# Altium schematic sheet Buffer_EXC.SchDoc
size A4; CompanyName: Technische Hochschule Nürnberg Georg Simon Ohm; DrawnBy: Bauer Martin; Engineer: Bauer Martin; Organization: UltraZohm; Address1: Kesslerplatz 12; Address2: 90489 Nürnberg; Address3: GERMANY; DocumentNumber: 4; SheetNumber: 4; SheetTotal: 6; Website: www.ultrazohm.com
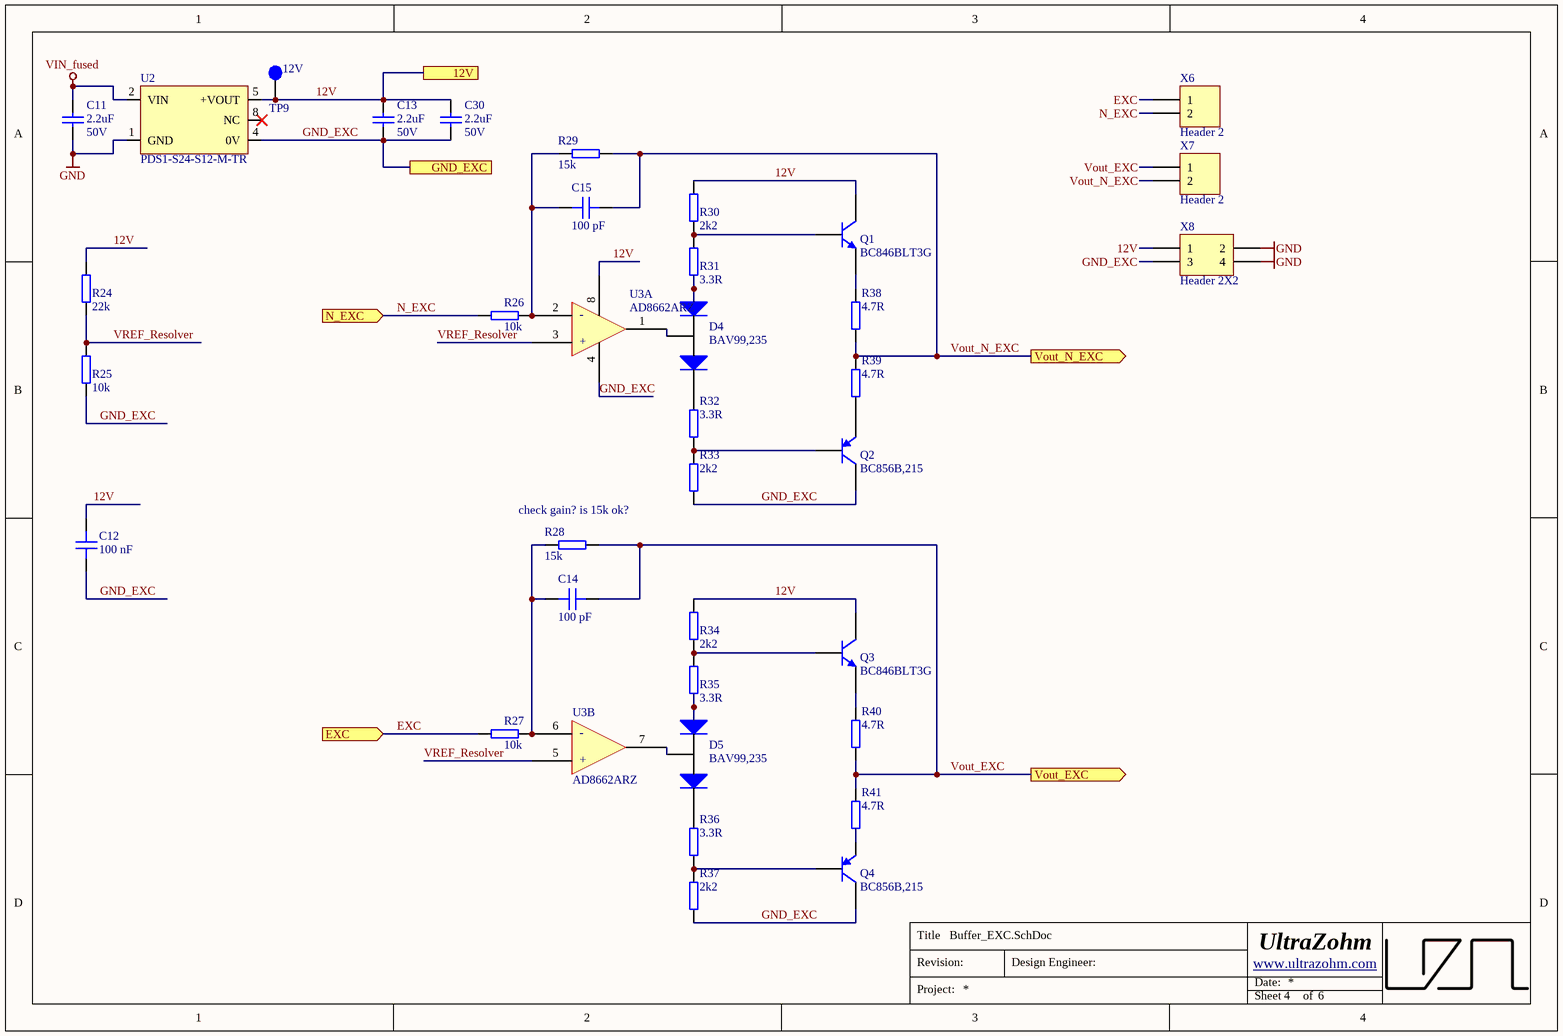
[diagram p0: Buffer_EXC.SchDoc]

## Parts
C11  2.2uF  Voltage: 50V  [RES_1206]
C12  100 nF  [C_0603]
C13  2.2uF  Voltage: 50V  [RES_1206]
C14  100 pF  [C_0603]
C15  100 pF  [C_0603]
C30  2.2uF  Voltage: 50V  [RES_1206]
D4  BAV99,235  [SOT-23]
D5  BAV99,235  [SOT-23]
Q1  BC846BLT3G  [SOT-23]
Q2  BC856B,215  [SOT-23]
Q3  BC846BLT3G  [SOT-23]
Q4  BC856B,215  [SOT-23]
R24  22k  [RES 0603_1608]
R25  10k  [RES 0603_1608]
R26  10k  [RES 0603_1608]
R27  10k  [RES 0603_1608]
R28  15k  [RES 0603_1608]
R29  15k  [RES 0603_1608]
R30  2k2  [RES 0603_1608]
R31  3.3R  [RES 0603_1608]
R32  3.3R  [RES 0603_1608]
R33  2k2  [RES 0603_1608]
R34  2k2  [RES 0603_1608]
R35  3.3R  [RES 0603_1608]
R36  3.3R  [RES 0603_1608]
R37  2k2  [RES 0603_1608]
R38  4.7R  [RES 0603_1608]
R39  4.7R  [RES 0603_1608]
R40  4.7R  [RES 0603_1608]
R41  4.7R  [RES 0603_1608]
TP9  12V  [TP_1mm]  (no BOM)
U2  PDS1-S24-S12-M-TR  [DC/DC 24V-->12V 1W Aislado]
U3  AD8662ARZ  [SOIC8_N]  (parts A,B of 2)
X6  Header 2  [HDR1X2]
X7  Header 2  [HDR1X2]
X8  Header 2X2  [HDR2X2]

## Ports
12V, EXC (in), GND_EXC, N_EXC (in), Vout_EXC (out), Vout_N_EXC (out)

## Nets
GND: C11.2 U2.1(GND) X8.2 X8.4
VIN_fused: C11.1 U2.2(VIN)
12V: C12.1 C13.1 C30.1 Q1.3(C) Q3.3(C) R24.2 R30.2 R34.2 TP9.1 U2.5(+VOUT) U3.8(v-) X8.1 ; port 12V
EXC: R27.2 X6.1 ; port EXC
GND_EXC: C12.2 C13.2 C30.2 Q2.3(C) Q4.3(C) R25.1 R33.2 R37.2 U2.4(0V) U3.4(v+) X8.3 ; port GND_EXC
N_EXC: R26.2 X6.2 ; port N_EXC
Vout_EXC: C14.2 R28.2 R40.2 R41.1 X7.1 ; port Vout_EXC
Vout_N_EXC: C15.2 R29.2 R38.2 R39.1 X7.2 ; port Vout_N_EXC
VREF_Resolver: R24.1 R25.2 U3.3(+in_a) U3.5(+in_b)
NetC14_1: C14.1 R27.1 R28.1 U3.6(-in_b)
NetC15_1: C15.1 R26.1 R29.1 U3.2(-in_a)
NetD4_1: D4.1 R31.1
NetD4_2: D4.2 R32.1
NetD4_3: D4.3 U3.1(out_a)
NetD5_1: D5.1 R35.1
NetD5_2: D5.2 R36.1
NetD5_3: D5.3 U3.7(out_b)
NetQ1_1: Q1.1(B) R30.1 R31.2
NetQ1_2: Q1.2(E) R38.1
NetQ2_1: Q2.1(B) R32.2 R33.1
NetQ2_2: Q2.2(E) R39.2
NetQ3_1: Q3.1(B) R34.1 R35.2
NetQ3_2: Q3.2(E) R40.1
NetQ4_1: Q4.1(B) R36.2 R37.1
NetQ4_2: Q4.2(E) R41.2

Not connected (* = marked no-connect by the designer): U2 8(NC)* 15(NC) 16(NC) 17(NC) 26(NC) 27(NC)

## Notes on the sheet
- check gain? is 15k ok?
- Title
- Revision:
- Design Engineer:
- Date:
- Project:
- Sheet
- of
- (in symbol AD8662, part A) -; +
- (in symbol AD8662, part B) -; +

## Library data of the parts
C11 C13 C30 = Cap_1206: Capacitor; Digikey Part-Number: *; Value: 2.2uF; Manufacturer Part-Number: *; LCSC Part Number: C50254
C12 = CC0603KRX7R9BB104: Capacitor 0603, 50 VDC, 100 nF, X7R; Manufacturer: YAGEO; Tolerance: 10 %; Voltage Rating: 50 VDC; Created from: AGeiger; Value: 100 nF; Supplier 1: LCSC; Supplier 2: Mouser; Supplier Part Number 1: C14663; Supplier Part Number 2: 603-CC603KRX7R9BB104; Manufacturer Part Number: CC0603KRX7R9BB104; PartID: 102; Created On: 22.08.2022 14:35:53; ComponentLink1Description: Datasheet; ComponentLink1URL: https://datasheet.lcsc.com/lcsc/1809301912_YAGEO-CC0603KRX7R9BB104_C14663.pdf; Component Type: Capacitor 0603; Device Package: 0603; Last Updated: 22.08.2022 14:35:53; Mounting Type: SMD; Operating Temperature: -55 - 125°C; Series: X7R; Type: Capacitor; Live Cycle Status: 1; LCSC Part Number: C14663
C14 C15 = CL10C101JB8NNNC: 50V 100pF C0G ±5% 0603 Multilayer Ceramic Capacitors MLCC - SMD/SMT ROHS; Manufacturer: Samsung Electro-Mechanics; Voltage Rating: 50 VDC; Created from: AGeiger; Value: 100 pF; Supplier 1: LCSC; Supplier Part Number 1: C14858; Manufacturer Part Number: CL10C101JB8NNNC; PartID: 106; Created On: 03.09.2022 10:55:28; ComponentLink1Description: Datasheet; ComponentLink1URL: https://datasheet.lcsc.com/lcsc/1811151136_Samsung-Electro-Mechanics-CL10C101JB8NNNC_C14858.pdf; Component Type: Capacitor 0603; Device Package: 0603; Last Updated: 03.09.2022 10:55:28; Mounting Type: SMD; Operating Temperature: -55 - 125°C; Series: C0G; Type: Capacitor; Tolerance: 5 %; Live Cycle Status: 1; LCSC Part Number: C14858
D4 D5 = Diode Array: DIODE ARRAY GP 100V 215MA SOT23; MF: Nexperia; Supplier Part Number 2: 1727-4311-1-ND; MPN: BAV99,235; Supplier 1: Mouser; Supplier 2: Digi-Key; Package: SOT-23-3; Supplier Part Number 1: 771-BAV99235; LCSC Part Number: C2500
Q1 Q3 = NPN Transistor BC846: NPN Bipolar Transistor; MF: ON Semiconductor; Supplier Part Number 2: BC846BLT3GOSCT-ND; MPN: BC846BLT3G; Supplier 1: Mouser; Supplier 2: Digi-Key; Supplier Part Number 1: 863-BC846BLT3G; Package: SOT-23-3; LCSC Part Number: C513271
Q2 Q4 = PNP Transistor BC846: PNP Bipolar Transistor; MF: Nexperia; Supplier Part Number 2: 1727-2925-1-ND; MPN: BC856B,215; Supplier Part Number 1: 771-BC856B-T/R; Supplier 1: Mouser; Supplier 2: Digi-Key; Package: SOT-23-3; LCSC Part Number: C109310
R24 = RK73B1JTTD223J: SMD resistor E24 series; Manufacturer: KOA Speer; Tolerance: 5%; Created from: MGremer; Value: 22k; Supplier 1: Mouser; Supplier Part Number 1: 660-RK73B1JTTD223J; Manufacturer Part Number: RK73B1JTTD223J; PartID: 106; Created On: 14.12.2020 16:17:14; ComponentLink1Description: Datasheet; ComponentLink1URL: https://www.mouser.de/datasheet/2/219/RK73B-1825463.pdf; Component Type: SMD resistor; Device Package: 0603; Last Updated: 01.02.2023 09:52:31; Mounting Type: SMD; Type: Resistor; Live Cycle Status: 1; Stock number: Labor SMD Container; LCSC Part Number: C31850
R25-R27 = RK73B1JTTD103J: SMD resistor E24 series; Manufacturer: KOA Speer; Tolerance: 5%; Created from: MGremer; Value: 10k; Supplier 1: Mouser; Supplier Part Number 1: 660-RK73B1JTTD103J; Manufacturer Part Number: RK73B1JTTD103J; PartID: 98; Created On: 14.12.2020 16:17:14; ComponentLink1Description: Datasheet; ComponentLink1URL: https://www.mouser.de/datasheet/2/219/RK73B-1825463.pdf; Component Type: SMD resistor; Device Package: 0603; Last Updated: 27.05.2022 14:04:22; Mounting Type: SMD; Type: Resistor; Live Cycle Status: 1; Stock number: Labor SMD Container; LCSC Part Number: C25804
R28 R29 = RK73B1JTTD153J: SMD resistor E24 series; Manufacturer: KOA Speer; Tolerance: 5%; Created from: MGremer; Value: 15k; Supplier 1: Mouser; Supplier Part Number 1: 660-RK73B1JTTD153J; Manufacturer Part Number: RK73B1JTTD153J; PartID: 102; Created On: 14.12.2020 16:17:14; ComponentLink1Description: Datasheet; ComponentLink1URL: https://www.mouser.de/datasheet/2/219/RK73B-1825463.pdf; Component Type: SMD resistor; Device Package: 0603; Last Updated: 27.05.2022 13:41:55; Mounting Type: SMD; Type: Resistor; Live Cycle Status: 1; Stock number: Labor SMD Container; LCSC Part Number: C22809
R30 R33 R34 R37 = RK73B1JTTD222J: SMD resistor E24 series; Manufacturer: KOA Speer; Tolerance: 5%; Created from: MGremer; Value: 2k2; Supplier 1: Mouser; Supplier Part Number 1: 660-RK73B1JTTD222J; Manufacturer Part Number: RK73B1JTTD222J; PartID: 82; Created On: 14.12.2020 16:17:14; ComponentLink1Description: Datasheet; ComponentLink1URL: https://www.mouser.de/datasheet/2/219/RK73B-1825463.pdf; Component Type: SMD resistor; Device Package: 0603; Last Updated: 31.01.2023 21:49:41; Mounting Type: SMD; Type: Resistor; Live Cycle Status: 1; Stock number: Labor SMD Container; LCSC Part Number: C4190
R31 R32 R35 R36 = RK73B1JTTDD3R3J: SMD resistor E24 series; Manufacturer: KOA Speer; Tolerance: 5%; Created from: MGremer; Value: 3.3R; Supplier 1: Mouser; Supplier Part Number 1: 660-RK73B1JTTDD3R3J; Manufacturer Part Number: RK73B1JTTDD3R3J; PartID: 14; Created On: 14.12.2020 16:17:14; ComponentLink1Description: Datasheet; ComponentLink1URL: https://www.mouser.de/datasheet/2/219/RK73B-1825463.pdf; Component Type: SMD resistor; Device Package: 0603; Last Updated: 31.01.2023 21:46:34; Mounting Type: SMD; Type: Resistor; Live Cycle Status: 1; Stock number: Labor SMD Container; LCSC Part Number: C25238
R38-R41 = RK73B1JTTDD4R7J: SMD resistor E24 series; Manufacturer: KOA Speer; Tolerance: 5%; Created from: MGremer; Value: 4.7R; Supplier 1: Mouser; Supplier Part Number 1: 660-RK73B1JTTDD4R7J; Manufacturer Part Number: RK73B1JTTDD4R7J; PartID: 18; Created On: 14.12.2020 16:17:14; ComponentLink1Description: Datasheet; ComponentLink1URL: https://www.mouser.de/datasheet/2/219/RK73B-1825463.pdf; Component Type: SMD resistor; Device Package: 0603; Last Updated: 31.01.2023 21:53:12; Mounting Type: SMD; Type: Resistor; Live Cycle Status: 1; Stock number: Labor SMD Container; LCSC Part Number: C23164
TP9 = TP_1mm: Testpoint 1mm; Created: 2018_06_25_AGeiger; Value: Testpoint 1mm
U2 = DC/DC +12V 1W: DC DC CONVERTER 12V 1W; MF: CUI; MPN: PDS1-S24-S12-M-TR; Supplier Part Number 2: 102-3406-1-ND; Package: 5-SMD; Supplier 1: Mouser; Supplier 2: Digi-Key; Supplier Part Number 1: 490-PDS1S24S12MTR; LCSC Part Number: C5707797
U3 = AD8662: IC OPAMP GP 2 CIRCUIT 14SOIC; MF: Analog Devices; MPN: AD8662ARZ; Supplier Part Number 2: AD8662ARZ-ND; Package: SOIC-8; Supplier 1: Mouser; Supplier 2: Digi-Key; Supplier Part Number 1: 584-AD8662ARZ; LCSC Part Number: C28133
X6 X7 = Header 2: Header, 2-Pin; LatestRevisionDate: 17-Jul-2002; LatestRevisionNote: Re-released for DXP Platform.; Publisher: Altium Limited
X8 = Header 2X2: Header, 2-Pin, Dual row; LatestRevisionDate: 17-Jul-2002; LatestRevisionNote: Re-released for DXP Platform.; Publisher: Altium Limited